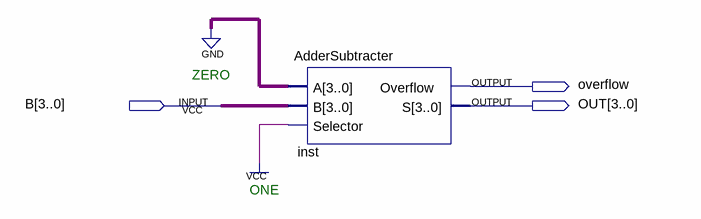
[diagram p0: schematic sheet]
// Quartus schematic Complemento2.bdf as structural Verilog: 1 symbols, 3 pins
module Complemento2 (
  input  [3:0] B,
  output overflow,
  output [3:0] OUT
);

  AdderSubtracter inst (.A(4'b0000), .B(B), .Selector(1'b1), .Overflow(overflow), .S(OUT));

  // Notes on the sheet:
  //   ZERO
  //   ONE
endmodule
